# Altium schematic sheet wifi.SchDoc
size A4
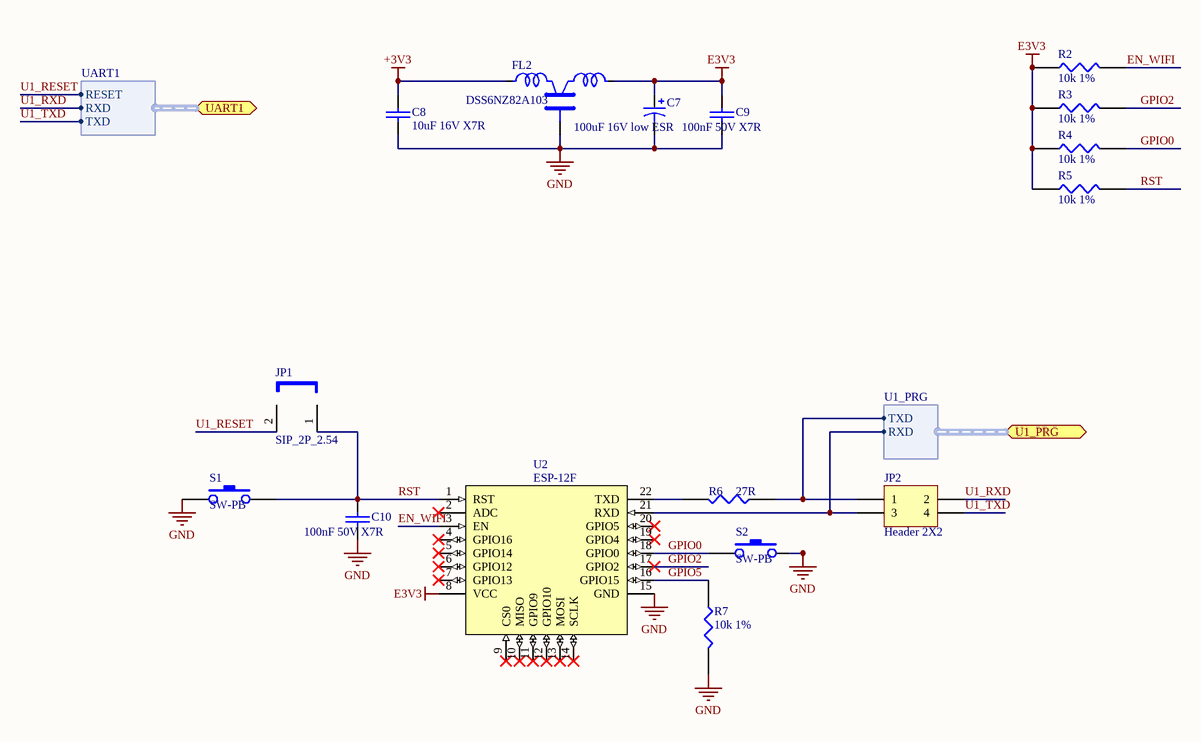
[diagram p0: wifi.SchDoc]

## Parts
C7  100uF 16V low ESR  [CAPPR2-5x11]
C8  10uF 16V X7R  [CAPC3216N]
C9  100nF 50V X7R  [CAPC2012N]
C10  100nF 50V X7R  [CAPC2012N]
FL2  DSS6NZ82A103  [DSS6]
JP1  SIP_2P_2.54  [JP2-P2.54]
JP2  Header 2X2  [HDR2X2]
R2  10k 1%  [RESC2012N]
R3  10k 1%  [RESC2012N]
R4  10k 1%  [RESC2012N]
R5  10k 1%  [RESC2012N]
R6  27R  [RESC2012N]
R7  10k 1%  [RESC2012N]
S1  SW-PB  [SW5X7]  (no BOM)
S2  SW-PB  [SW5X7]  (no BOM)
U2  ESP-12F  [ESP-12F]

## Ports
U1_PRG (harness U1_PRG), UART1 (harness UART1)

## Harnesses
U1_PRG: TXD, RXD
UART1: TXD, RXD, RESET

## Nets
+3V3: C8.1 FL2.1
E3V3: C7.1 C9.1 FL2.3 R2.1 R3.1 R4.1 R5.1 U2.8(VCC)
GND: C7.2 C8.2 C9.2 C10.2 FL2.2 R7.2 S1.1 S2.2 U2.15(GND)
EN_WIFI: R2.2 U2.3(EN)
GPIO0: R4.2 S2.1 U2.18(GPIO0)
GPIO2: R3.2 U2.17(GPIO2)
GPIO5: R7.1 U2.16(GPIO15)
RST: C10.1 JP1.1 R5.2 S1.2 U2.1(RST)
U1_RESET: JP1.2 ; port UART1.RESET
U1_RXD: JP2.2 ; port UART1.RXD
U1_TXD: JP2.4 ; port UART1.TXD
NetJP2_1: JP2.1 R6.1 ; port U1_PRG.TXD
NetJP2_3: JP2.3 U2.21(RXD) ; port U1_PRG.RXD
NetR6_2: R6.2 U2.22(TXD)

Not connected (* = marked no-connect by the designer): U2 2(ADC)* 4(GPIO16)* 5(GPIO14)* 6(GPIO12)* 7(GPIO13)* 9(CS0)* 10(MISO)* 11(GPIO9)* 12(GPIO10)* 13(MOSI)* 14(SCLK)* 19(GPIO4)* 20(GPIO5)*

## Library data of the parts
C7 = Cap Pol1: Polarized Capacitor (Radial); Price: 0.38
C8-C10 = CAP: Price: 0.025
FL2 = DSS6: Murata EMI suppression filter; Manufacturer: Murata; Price: 0.5
JP1 = JUMPER
JP2 = Header 2X2: Header, 2-Pin, Dual row; LatestRevisionDate: 17-Jul-2002; LatestRevisionNote: Re-released for DXP Platform.; Publisher: Altium Limited
R2-R7 = RES1
U2 = ESP-12F: Wi-Fi module; Manufacturer: Ai-Thinker; Price: 11.8